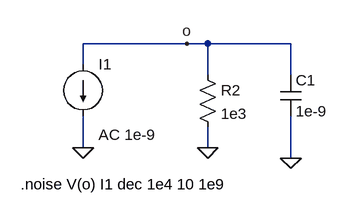
[diagram p0: schematic resistencia.asc]
resistencia.asc, the LTspice schematic file:
Version 4
SHEET 1 880 680
WIRE 144 -128 -16 -128
WIRE 176 -128 144 -128
WIRE 304 -128 176 -128
WIRE -16 -96 -16 -128
WIRE 176 -80 176 -128
WIRE 304 -80 304 -128
WIRE -16 32 -16 -16
WIRE 176 32 176 0
WIRE 304 48 304 -16
FLAG -16 32 0
FLAG 176 32 0
FLAG 144 -128 o
FLAG 304 48 0
SYMBOL current -16 -96 R0
WINDOW 123 24 108 Left 2
WINDOW 39 0 0 Left 2
SYMATTR InstName I1
SYMATTR Value ""
SYMATTR Value2 AC 1e-9
SYMBOL res 160 -96 R0
SYMATTR InstName R2
SYMATTR Value 1e3
SYMBOL cap 288 -80 R0
SYMATTR InstName C1
SYMATTR Value 1e-9
TEXT -112 88 Left 2 !.noise V(o) I1 dec 1e4 10 1e9

The netlist it stands for:
* resistencia.asc
I1 o 0 AC 1e-9
R2 o 0 1e3
C1 o 0 1e-9
.noise V(o) I1 dec 1e4 10 1e9
.backanno
.end